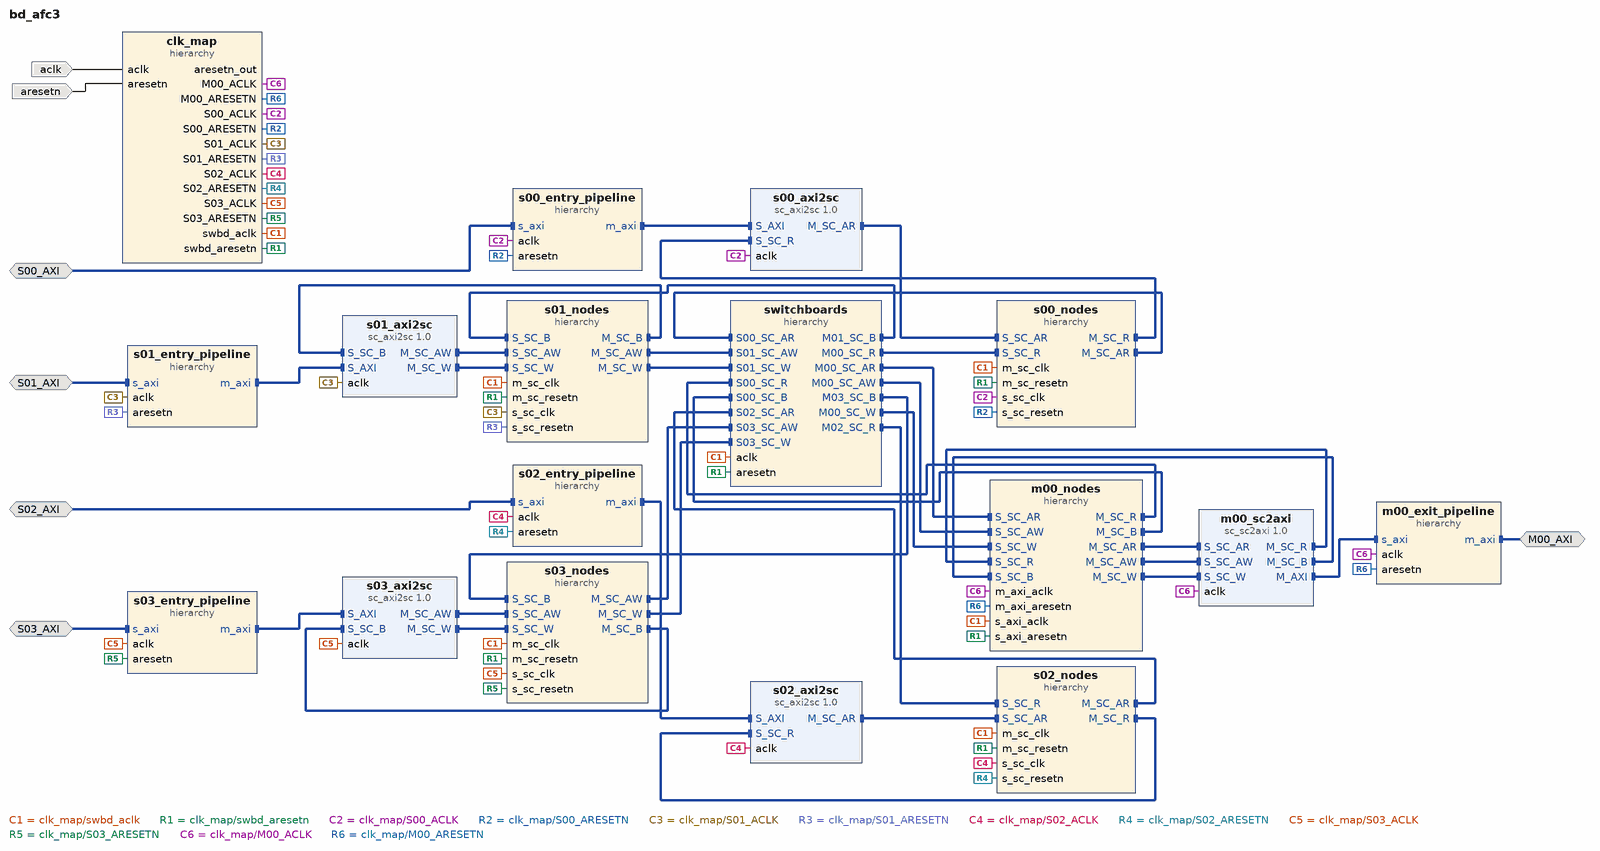
[diagram p0: block diagram of the top level]
# Vivado block design bd_afc3, xc7z020clg484-1, Vivado 2018.2
create_bd_design bd_afc3

create_bd_intf_port -mode Slave -vlnv xilinx.com:interface:aximm_rtl:1.0 S00_AXI
create_bd_intf_port -mode Slave -vlnv xilinx.com:interface:aximm_rtl:1.0 S01_AXI
create_bd_intf_port -mode Slave -vlnv xilinx.com:interface:aximm_rtl:1.0 S02_AXI
create_bd_intf_port -mode Slave -vlnv xilinx.com:interface:aximm_rtl:1.0 S03_AXI
create_bd_intf_port -mode Master -vlnv xilinx.com:interface:aximm_rtl:1.0 M00_AXI
set_property -dict [list \
  CONFIG.SUPPORTS_NARROW_BURST 0 \
  CONFIG.MAX_BURST_LENGTH 8 \
  CONFIG.RUSER_BITS_PER_BYTE 0 \
  CONFIG.WUSER_BITS_PER_BYTE 0 \
] [get_bd_intf_ports M00_AXI]
create_bd_port -dir I -type clk aclk
set_property -dict {CONFIG.ASSOCIATED_BUSIF M00_AXI:S00_AXI:S01_AXI:S02_AXI:S03_AXI} [get_bd_ports aclk]
create_bd_port -dir I -type rst aresetn
set_property -dict {CONFIG.POLARITY ACTIVE_LOW} [get_bd_ports aresetn]

create_bd_cell -type hier clk_map
create_bd_cell -type hier switchboards
create_bd_cell -type hier s00_entry_pipeline
create_bd_cell -type ip -vlnv xilinx.com:ip:sc_axi2sc:1.0 s00_axi2sc
set_property -dict [list \
  CONFIG.READ_WRITE_MODE READ_ONLY \
  CONFIG.AXI_ADDR_WIDTH 32 \
  CONFIG.AXI_ID_WIDTH 2 \
  CONFIG.AXI_RDATA_WIDTH 32 \
  CONFIG.AXI_WDATA_WIDTH 32 \
  CONFIG.SC_ADDR_WIDTH 32 \
  CONFIG.SC_ID_WIDTH 2 \
  CONFIG.SC_RDATA_WIDTH 64 \
  CONFIG.SC_WDATA_WIDTH 64 \
  CONFIG.SC_ARUSER_WIDTH 0 \
  CONFIG.SC_AWUSER_WIDTH 0 \
  CONFIG.SC_BUSER_WIDTH 0 \
  CONFIG.SC_WUSER_BITS_PER_BYTE 0 \
  CONFIG.SC_RUSER_BITS_PER_BYTE 0 \
  CONFIG.MSC_ROUTE_WIDTH 1 \
  CONFIG.SSC_ROUTE_WIDTH 4 \
] [get_bd_cells s00_axi2sc]
create_bd_cell -type hier s00_nodes
create_bd_cell -type hier s01_entry_pipeline
create_bd_cell -type ip -vlnv xilinx.com:ip:sc_axi2sc:1.0 s01_axi2sc
set_property -dict [list \
  CONFIG.READ_WRITE_MODE WRITE_ONLY \
  CONFIG.AXI_ADDR_WIDTH 32 \
  CONFIG.AXI_ID_WIDTH 2 \
  CONFIG.AXI_RDATA_WIDTH 32 \
  CONFIG.AXI_WDATA_WIDTH 32 \
  CONFIG.SC_ADDR_WIDTH 32 \
  CONFIG.SC_ID_WIDTH 2 \
  CONFIG.SC_RDATA_WIDTH 64 \
  CONFIG.SC_WDATA_WIDTH 64 \
  CONFIG.SC_ARUSER_WIDTH 0 \
  CONFIG.SC_AWUSER_WIDTH 0 \
  CONFIG.SC_BUSER_WIDTH 0 \
  CONFIG.SC_WUSER_BITS_PER_BYTE 0 \
  CONFIG.SC_RUSER_BITS_PER_BYTE 0 \
  CONFIG.MSC_ROUTE_WIDTH 1 \
  CONFIG.SSC_ROUTE_WIDTH 4 \
] [get_bd_cells s01_axi2sc]
create_bd_cell -type hier s01_nodes
create_bd_cell -type hier s02_entry_pipeline
create_bd_cell -type ip -vlnv xilinx.com:ip:sc_axi2sc:1.0 s02_axi2sc
set_property -dict [list \
  CONFIG.READ_WRITE_MODE READ_ONLY \
  CONFIG.AXI_ADDR_WIDTH 32 \
  CONFIG.AXI_ID_WIDTH 2 \
  CONFIG.AXI_RDATA_WIDTH 32 \
  CONFIG.AXI_WDATA_WIDTH 32 \
  CONFIG.SC_ADDR_WIDTH 32 \
  CONFIG.SC_ID_WIDTH 2 \
  CONFIG.SC_RDATA_WIDTH 64 \
  CONFIG.SC_WDATA_WIDTH 64 \
  CONFIG.SC_ARUSER_WIDTH 0 \
  CONFIG.SC_AWUSER_WIDTH 0 \
  CONFIG.SC_BUSER_WIDTH 0 \
  CONFIG.SC_WUSER_BITS_PER_BYTE 0 \
  CONFIG.SC_RUSER_BITS_PER_BYTE 0 \
  CONFIG.MSC_ROUTE_WIDTH 1 \
  CONFIG.SSC_ROUTE_WIDTH 4 \
] [get_bd_cells s02_axi2sc]
create_bd_cell -type hier s02_nodes
create_bd_cell -type hier s03_entry_pipeline
create_bd_cell -type ip -vlnv xilinx.com:ip:sc_axi2sc:1.0 s03_axi2sc
set_property -dict [list \
  CONFIG.READ_WRITE_MODE WRITE_ONLY \
  CONFIG.AXI_ADDR_WIDTH 32 \
  CONFIG.AXI_ID_WIDTH 2 \
  CONFIG.AXI_RDATA_WIDTH 32 \
  CONFIG.AXI_WDATA_WIDTH 32 \
  CONFIG.SC_ADDR_WIDTH 32 \
  CONFIG.SC_ID_WIDTH 2 \
  CONFIG.SC_RDATA_WIDTH 64 \
  CONFIG.SC_WDATA_WIDTH 64 \
  CONFIG.SC_ARUSER_WIDTH 0 \
  CONFIG.SC_AWUSER_WIDTH 0 \
  CONFIG.SC_BUSER_WIDTH 0 \
  CONFIG.SC_WUSER_BITS_PER_BYTE 0 \
  CONFIG.SC_RUSER_BITS_PER_BYTE 0 \
  CONFIG.MSC_ROUTE_WIDTH 1 \
  CONFIG.SSC_ROUTE_WIDTH 4 \
] [get_bd_cells s03_axi2sc]
create_bd_cell -type hier s03_nodes
create_bd_cell -type ip -vlnv xilinx.com:ip:sc_sc2axi:1.0 m00_sc2axi
set_property -dict [list \
  CONFIG.READ_WRITE_MODE READ_WRITE \
  CONFIG.AXI_ADDR_WIDTH 32 \
  CONFIG.AXI_ID_WIDTH 2 \
  CONFIG.AXI_RDATA_WIDTH 64 \
  CONFIG.AXI_WDATA_WIDTH 64 \
  CONFIG.SC_ADDR_WIDTH 32 \
  CONFIG.SC_ID_WIDTH 2 \
  CONFIG.SC_RDATA_WIDTH 64 \
  CONFIG.SC_WDATA_WIDTH 64 \
  CONFIG.SC_ARUSER_WIDTH 0 \
  CONFIG.SC_AWUSER_WIDTH 0 \
  CONFIG.SC_BUSER_WIDTH 0 \
  CONFIG.SC_WUSER_BITS_PER_BYTE 0 \
  CONFIG.SC_RUSER_BITS_PER_BYTE 0 \
  CONFIG.MSC_ROUTE_WIDTH 1 \
  CONFIG.SSC_ROUTE_WIDTH 4 \
] [get_bd_cells m00_sc2axi]
create_bd_cell -type hier m00_nodes
create_bd_cell -type hier m00_exit_pipeline

# ---- hierarchy /clk_map ----
current_bd_instance /clk_map
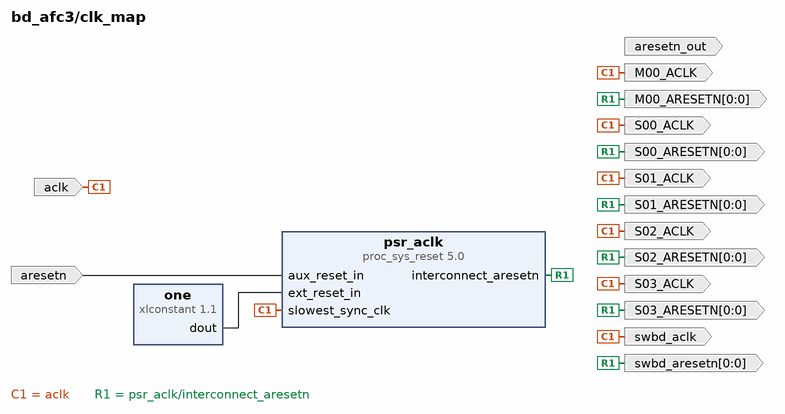
[diagram p1: block diagram inside /clk_map]
create_bd_pin -dir O -type clk S00_ACLK
create_bd_pin -dir O -from 0 -to 0 -type rst S00_ARESETN
create_bd_pin -dir O -type clk S01_ACLK
create_bd_pin -dir O -from 0 -to 0 -type rst S01_ARESETN
create_bd_pin -dir O -type clk S02_ACLK
create_bd_pin -dir O -from 0 -to 0 -type rst S02_ARESETN
create_bd_pin -dir O -type clk S03_ACLK
create_bd_pin -dir O -from 0 -to 0 -type rst S03_ARESETN
create_bd_pin -dir O -type clk M00_ACLK
create_bd_pin -dir O -from 0 -to 0 -type rst M00_ARESETN
create_bd_pin -dir O -type clk swbd_aclk
create_bd_pin -dir O -from 0 -to 0 -type rst swbd_aresetn
create_bd_pin -dir I -type rst aresetn
create_bd_pin -dir O -type rst aresetn_out
create_bd_pin -dir I -type clk aclk

create_bd_cell -type ip -vlnv xilinx.com:ip:xlconstant:1.1 one
create_bd_cell -type ip -vlnv xilinx.com:ip:proc_sys_reset:5.0 psr_aclk
set_property -dict {CONFIG.C_AUX_RESET_HIGH 0 CONFIG.C_AUX_RST_WIDTH 1} [get_bd_cells psr_aclk]

# ---- hierarchy /switchboards ----
current_bd_instance /switchboards
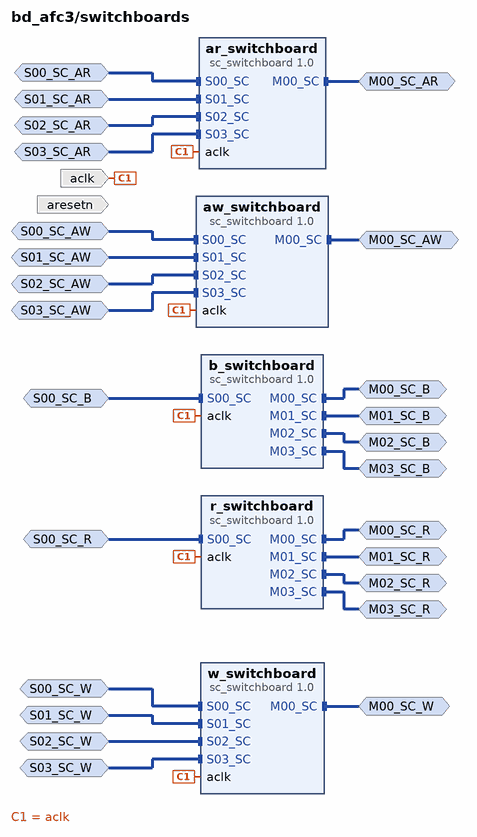
[diagram p2: block diagram inside /switchboards]
create_bd_intf_pin -mode Slave -vlnv xilinx.com:interface:sc_rtl:1.0 S00_SC_AR
create_bd_intf_pin -mode Slave -vlnv xilinx.com:interface:sc_rtl:1.0 S01_SC_AR
create_bd_intf_pin -mode Slave -vlnv xilinx.com:interface:sc_rtl:1.0 S02_SC_AR
create_bd_intf_pin -mode Slave -vlnv xilinx.com:interface:sc_rtl:1.0 S03_SC_AR
create_bd_intf_pin -mode Master -vlnv xilinx.com:interface:sc_rtl:1.0 M00_SC_AR
create_bd_intf_pin -mode Slave -vlnv xilinx.com:interface:sc_rtl:1.0 S00_SC_R
create_bd_intf_pin -mode Master -vlnv xilinx.com:interface:sc_rtl:1.0 M00_SC_R
create_bd_intf_pin -mode Master -vlnv xilinx.com:interface:sc_rtl:1.0 M01_SC_R
create_bd_intf_pin -mode Master -vlnv xilinx.com:interface:sc_rtl:1.0 M02_SC_R
create_bd_intf_pin -mode Master -vlnv xilinx.com:interface:sc_rtl:1.0 M03_SC_R
create_bd_intf_pin -mode Slave -vlnv xilinx.com:interface:sc_rtl:1.0 S00_SC_AW
create_bd_intf_pin -mode Slave -vlnv xilinx.com:interface:sc_rtl:1.0 S01_SC_AW
create_bd_intf_pin -mode Slave -vlnv xilinx.com:interface:sc_rtl:1.0 S02_SC_AW
create_bd_intf_pin -mode Slave -vlnv xilinx.com:interface:sc_rtl:1.0 S03_SC_AW
create_bd_intf_pin -mode Master -vlnv xilinx.com:interface:sc_rtl:1.0 M00_SC_AW
create_bd_intf_pin -mode Slave -vlnv xilinx.com:interface:sc_rtl:1.0 S00_SC_W
create_bd_intf_pin -mode Slave -vlnv xilinx.com:interface:sc_rtl:1.0 S01_SC_W
create_bd_intf_pin -mode Slave -vlnv xilinx.com:interface:sc_rtl:1.0 S02_SC_W
create_bd_intf_pin -mode Slave -vlnv xilinx.com:interface:sc_rtl:1.0 S03_SC_W
create_bd_intf_pin -mode Master -vlnv xilinx.com:interface:sc_rtl:1.0 M00_SC_W
create_bd_intf_pin -mode Slave -vlnv xilinx.com:interface:sc_rtl:1.0 S00_SC_B
create_bd_intf_pin -mode Master -vlnv xilinx.com:interface:sc_rtl:1.0 M00_SC_B
create_bd_intf_pin -mode Master -vlnv xilinx.com:interface:sc_rtl:1.0 M01_SC_B
create_bd_intf_pin -mode Master -vlnv xilinx.com:interface:sc_rtl:1.0 M02_SC_B
create_bd_intf_pin -mode Master -vlnv xilinx.com:interface:sc_rtl:1.0 M03_SC_B
create_bd_pin -dir I -type clk aclk
create_bd_pin -dir I -type rst aresetn

create_bd_cell -type ip -vlnv xilinx.com:ip:sc_switchboard:1.0 ar_switchboard
set_property -dict [list \
  CONFIG.S_PIPELINES 0 \
  CONFIG.M_PIPELINES 1 \
  CONFIG.S_LATENCY 0 \
  CONFIG.NUM_SI 4 \
  CONFIG.NUM_MI 1 \
  CONFIG.PAYLD_WIDTH 140 \
  CONFIG.M00_S00_CONNECTIVITY 1 \
  CONFIG.M00_S01_CONNECTIVITY 1 \
  CONFIG.M00_S02_CONNECTIVITY 1 \
  CONFIG.M00_S03_CONNECTIVITY 1 \
] [get_bd_cells ar_switchboard]
create_bd_cell -type ip -vlnv xilinx.com:ip:sc_switchboard:1.0 r_switchboard
set_property -dict [list \
  CONFIG.S_PIPELINES 0 \
  CONFIG.M_PIPELINES 1 \
  CONFIG.S_LATENCY 0 \
  CONFIG.NUM_SI 1 \
  CONFIG.NUM_MI 4 \
  CONFIG.PAYLD_WIDTH 87 \
  CONFIG.M00_S00_CONNECTIVITY 1 \
  CONFIG.M01_S00_CONNECTIVITY 1 \
  CONFIG.M02_S00_CONNECTIVITY 1 \
  CONFIG.M03_S00_CONNECTIVITY 1 \
] [get_bd_cells r_switchboard]
create_bd_cell -type ip -vlnv xilinx.com:ip:sc_switchboard:1.0 aw_switchboard
set_property -dict [list \
  CONFIG.S_PIPELINES 0 \
  CONFIG.M_PIPELINES 1 \
  CONFIG.S_LATENCY 0 \
  CONFIG.NUM_SI 4 \
  CONFIG.NUM_MI 1 \
  CONFIG.PAYLD_WIDTH 140 \
  CONFIG.M00_S00_CONNECTIVITY 1 \
  CONFIG.M00_S01_CONNECTIVITY 1 \
  CONFIG.M00_S02_CONNECTIVITY 1 \
  CONFIG.M00_S03_CONNECTIVITY 1 \
] [get_bd_cells aw_switchboard]
create_bd_cell -type ip -vlnv xilinx.com:ip:sc_switchboard:1.0 w_switchboard
set_property -dict [list \
  CONFIG.S_PIPELINES 0 \
  CONFIG.M_PIPELINES 1 \
  CONFIG.S_LATENCY 0 \
  CONFIG.NUM_SI 4 \
  CONFIG.NUM_MI 1 \
  CONFIG.PAYLD_WIDTH 88 \
  CONFIG.M00_S00_CONNECTIVITY 1 \
  CONFIG.M00_S01_CONNECTIVITY 1 \
  CONFIG.M00_S02_CONNECTIVITY 1 \
  CONFIG.M00_S03_CONNECTIVITY 1 \
] [get_bd_cells w_switchboard]
create_bd_cell -type ip -vlnv xilinx.com:ip:sc_switchboard:1.0 b_switchboard
set_property -dict [list \
  CONFIG.S_PIPELINES 0 \
  CONFIG.M_PIPELINES 1 \
  CONFIG.S_LATENCY 0 \
  CONFIG.NUM_SI 1 \
  CONFIG.NUM_MI 4 \
  CONFIG.PAYLD_WIDTH 9 \
  CONFIG.M00_S00_CONNECTIVITY 1 \
  CONFIG.M01_S00_CONNECTIVITY 1 \
  CONFIG.M02_S00_CONNECTIVITY 1 \
  CONFIG.M03_S00_CONNECTIVITY 1 \
] [get_bd_cells b_switchboard]

# ---- hierarchy /s00_entry_pipeline ----
current_bd_instance /s00_entry_pipeline
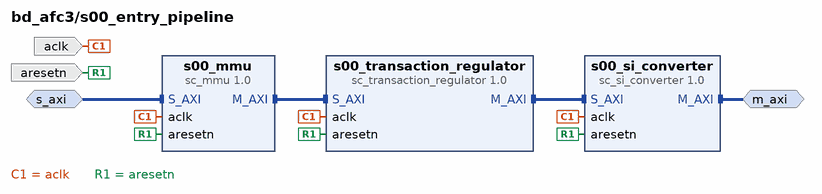
[diagram p3: block diagram inside /s00_entry_pipeline]
create_bd_intf_pin -mode Slave -vlnv xilinx.com:interface:aximm_rtl:1.0 s_axi
create_bd_intf_pin -mode Master -vlnv xilinx.com:interface:aximm_rtl:1.0 m_axi
create_bd_pin -dir I -type clk aclk
create_bd_pin -dir I -type rst aresetn

create_bd_cell -type ip -vlnv xilinx.com:ip:sc_mmu:1.0 s00_mmu
set_property -dict [list \
  CONFIG.IS_CASCADED 0 \
  CONFIG.NUM_SEG 2 \
  CONFIG.MSC_ROUTE_WIDTH 1 \
  CONFIG.NUM_MSC 1 \
  CONFIG.ADDR_WIDTH 32 \
  CONFIG.ID_WIDTH 0 \
  CONFIG.RDATA_WIDTH 32 \
  CONFIG.WDATA_WIDTH 32 \
  CONFIG.S_ARUSER_WIDTH 0 \
  CONFIG.S_RUSER_WIDTH 0 \
  CONFIG.S_WUSER_WIDTH 0 \
  CONFIG.S_PROTOCOL AXI4 \
  CONFIG.READ_WRITE_MODE READ_ONLY \
  CONFIG.SEG000_BASE_ADDR 0x0000000000000000 \
  CONFIG.SEG000_SIZE 29 \
  CONFIG.SEG000_SEP_ROUTE 0b0000000000000000000000000000000000000000000000000000000000000000 \
  CONFIG.SEG000_SUPPORTS_READ 1 \
  CONFIG.SEG000_SUPPORTS_WRITE 1 \
  CONFIG.SEG000_SECURE_READ 0 \
  CONFIG.SEG000_SECURE_WRITE 0 \
  CONFIG.SEG001_BASE_ADDR 0x00000000FC000000 \
  CONFIG.SEG001_SIZE 24 \
  CONFIG.SEG001_SEP_ROUTE 0b0000000000000000000000000000000000000000000000000000000000000000 \
  CONFIG.SEG001_SUPPORTS_READ 1 \
  CONFIG.SEG001_SUPPORTS_WRITE 1 \
  CONFIG.SEG001_SECURE_READ 0 \
  CONFIG.SEG001_SECURE_WRITE 0 \
  CONFIG.MSC000_ROUTE 0b1 \
] [get_bd_cells s00_mmu]
create_bd_cell -type ip -vlnv xilinx.com:ip:sc_transaction_regulator:1.0 s00_transaction_regulator
set_property -dict [list \
  CONFIG.READ_WRITE_MODE READ_ONLY \
  CONFIG.IS_CASCADED 0 \
  CONFIG.MEP_IDENTIFIER 0 \
  CONFIG.MEP_IDENTIFIER_WIDTH 2 \
  CONFIG.ADDR_WIDTH 32 \
  CONFIG.S_ID_WIDTH 0 \
  CONFIG.WDATA_WIDTH 32 \
  CONFIG.RDATA_WIDTH 32 \
  CONFIG.SEP_ROUTE_WIDTH 1 \
  CONFIG.SUPPORTS_READ_DEADLOCK 1 \
  CONFIG.SUPPORTS_WRITE_DEADLOCK 0 \
] [get_bd_cells s00_transaction_regulator]
create_bd_cell -type ip -vlnv xilinx.com:ip:sc_si_converter:1.0 s00_si_converter
set_property -dict [list \
  CONFIG.READ_WRITE_MODE READ_ONLY \
  CONFIG.LIMIT_READ_LENGTH 0 \
  CONFIG.LIMIT_WRITE_LENGTH 0 \
  CONFIG.IS_CASCADED 0 \
  CONFIG.NUM_READ_THREADS 1 \
  CONFIG.NUM_WRITE_THREADS 1 \
  CONFIG.MEP_IDENTIFIER_WIDTH 2 \
  CONFIG.SUPPORTS_NARROW 0 \
  CONFIG.HAS_BURST 0 \
  CONFIG.NUM_SEG 2 \
  CONFIG.ADDR_WIDTH 32 \
  CONFIG.ID_WIDTH 2 \
  CONFIG.RDATA_WIDTH 32 \
  CONFIG.WDATA_WIDTH 32 \
  CONFIG.NUM_MSC 1 \
  CONFIG.S_RUSER_BITS_PER_BYTE 0 \
  CONFIG.S_WUSER_BITS_PER_BYTE 0 \
  CONFIG.MAX_RUSER_BITS_PER_BYTE 0 \
  CONFIG.MAX_WUSER_BITS_PER_BYTE 0 \
  CONFIG.SEP000_RDATA_WIDTH 64 \
  CONFIG.SEP000_WDATA_WIDTH 64 \
  CONFIG.SEP000_PROTOCOL AXI3 \
  CONFIG.SEP001_RDATA_WIDTH 64 \
  CONFIG.SEP001_WDATA_WIDTH 64 \
  CONFIG.SEP001_PROTOCOL AXI3 \
  CONFIG.MSC000_RDATA_WIDTH 64 \
  CONFIG.MSC000_WDATA_WIDTH 64 \
] [get_bd_cells s00_si_converter]

# ---- hierarchy /s00_nodes ----
current_bd_instance /s00_nodes
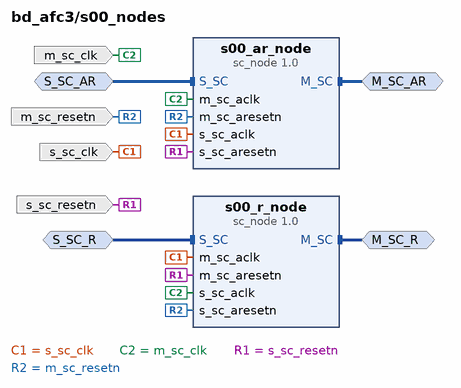
[diagram p4: block diagram inside /s00_nodes]
create_bd_intf_pin -mode Master -vlnv xilinx.com:interface:sc_rtl:1.0 M_SC_AR
create_bd_intf_pin -mode Slave -vlnv xilinx.com:interface:sc_rtl:1.0 S_SC_AR
create_bd_intf_pin -mode Master -vlnv xilinx.com:interface:sc_rtl:1.0 M_SC_R
create_bd_intf_pin -mode Slave -vlnv xilinx.com:interface:sc_rtl:1.0 S_SC_R
create_bd_pin -dir I -type clk s_sc_clk
create_bd_pin -dir I -type rst s_sc_resetn
create_bd_pin -dir I -type clk m_sc_clk
create_bd_pin -dir I -type rst m_sc_resetn

create_bd_cell -type ip -vlnv xilinx.com:ip:sc_node:1.0 s00_ar_node
set_property -dict [list \
  CONFIG.NUM_SI 1 \
  CONFIG.NUM_MI 1 \
  CONFIG.CHANNEL 2 \
  CONFIG.MAX_PAYLD_BYTES 8 \
  CONFIG.SC_ROUTE_WIDTH 1 \
  CONFIG.ID_WIDTH 2 \
  CONFIG.PAYLD_WIDTH 140 \
  CONFIG.ADDR_WIDTH 32 \
  CONFIG.USER_WIDTH 0 \
  CONFIG.M_PIPELINE 0 \
  CONFIG.ACLK_RELATIONSHIP 1 \
  CONFIG.ACLKEN_CONVERSION 0 \
  CONFIG.S00_NUM_BYTES 4 \
  CONFIG.S01_NUM_BYTES 4 \
  CONFIG.S02_NUM_BYTES 4 \
  CONFIG.S03_NUM_BYTES 4 \
  CONFIG.S04_NUM_BYTES 4 \
  CONFIG.S05_NUM_BYTES 4 \
  CONFIG.S06_NUM_BYTES 4 \
  CONFIG.S07_NUM_BYTES 4 \
  CONFIG.S08_NUM_BYTES 4 \
  CONFIG.S09_NUM_BYTES 4 \
  CONFIG.S10_NUM_BYTES 4 \
  CONFIG.S11_NUM_BYTES 4 \
  CONFIG.S12_NUM_BYTES 4 \
  CONFIG.S13_NUM_BYTES 4 \
  CONFIG.S14_NUM_BYTES 4 \
  CONFIG.S15_NUM_BYTES 4 \
  CONFIG.M00_NUM_BYTES 8 \
  CONFIG.M01_NUM_BYTES 8 \
  CONFIG.M02_NUM_BYTES 8 \
  CONFIG.M03_NUM_BYTES 8 \
  CONFIG.M04_NUM_BYTES 8 \
  CONFIG.M05_NUM_BYTES 8 \
  CONFIG.M06_NUM_BYTES 8 \
  CONFIG.M07_NUM_BYTES 8 \
  CONFIG.M08_NUM_BYTES 8 \
  CONFIG.M09_NUM_BYTES 8 \
  CONFIG.M10_NUM_BYTES 8 \
  CONFIG.M11_NUM_BYTES 8 \
  CONFIG.M12_NUM_BYTES 8 \
  CONFIG.M13_NUM_BYTES 8 \
  CONFIG.M14_NUM_BYTES 8 \
  CONFIG.M15_NUM_BYTES 8 \
] [get_bd_cells s00_ar_node]
create_bd_cell -type ip -vlnv xilinx.com:ip:sc_node:1.0 s00_r_node
set_property -dict [list \
  CONFIG.NUM_SI 1 \
  CONFIG.NUM_MI 1 \
  CONFIG.CHANNEL 0 \
  CONFIG.USER_BITS_PER_BYTE 0 \
  CONFIG.MAX_PAYLD_BYTES 8 \
  CONFIG.SC_ROUTE_WIDTH 4 \
  CONFIG.ID_WIDTH 2 \
  CONFIG.PAYLD_WIDTH 87 \
  CONFIG.ADDR_WIDTH 32 \
  CONFIG.M_SEND_PIPELINE 0 \
  CONFIG.S_LATENCY 1 \
  CONFIG.ACLK_RELATIONSHIP 1 \
  CONFIG.ACLKEN_CONVERSION 0 \
  CONFIG.S00_NUM_BYTES 8 \
  CONFIG.S01_NUM_BYTES 8 \
  CONFIG.S02_NUM_BYTES 8 \
  CONFIG.S03_NUM_BYTES 8 \
  CONFIG.S04_NUM_BYTES 8 \
  CONFIG.S05_NUM_BYTES 8 \
  CONFIG.S06_NUM_BYTES 8 \
  CONFIG.S07_NUM_BYTES 8 \
  CONFIG.S08_NUM_BYTES 8 \
  CONFIG.S09_NUM_BYTES 8 \
  CONFIG.S10_NUM_BYTES 8 \
  CONFIG.S11_NUM_BYTES 8 \
  CONFIG.S12_NUM_BYTES 8 \
  CONFIG.S13_NUM_BYTES 8 \
  CONFIG.S14_NUM_BYTES 8 \
  CONFIG.S15_NUM_BYTES 8 \
  CONFIG.M00_NUM_BYTES 4 \
  CONFIG.M01_NUM_BYTES 4 \
  CONFIG.M02_NUM_BYTES 4 \
  CONFIG.M03_NUM_BYTES 4 \
  CONFIG.M04_NUM_BYTES 4 \
  CONFIG.M05_NUM_BYTES 4 \
  CONFIG.M06_NUM_BYTES 4 \
  CONFIG.M07_NUM_BYTES 4 \
  CONFIG.M08_NUM_BYTES 4 \
  CONFIG.M09_NUM_BYTES 4 \
  CONFIG.M10_NUM_BYTES 4 \
  CONFIG.M11_NUM_BYTES 4 \
  CONFIG.M12_NUM_BYTES 4 \
  CONFIG.M13_NUM_BYTES 4 \
  CONFIG.M14_NUM_BYTES 4 \
  CONFIG.M15_NUM_BYTES 4 \
] [get_bd_cells s00_r_node]

# ---- hierarchy /s01_entry_pipeline ----
current_bd_instance /s01_entry_pipeline
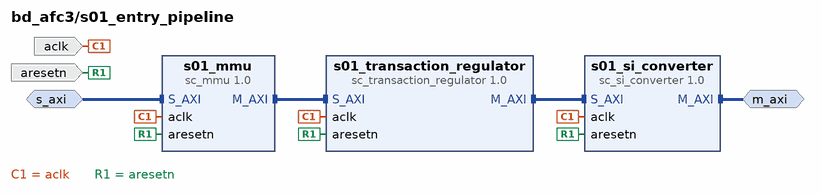
[diagram p5: block diagram inside /s01_entry_pipeline]
create_bd_intf_pin -mode Slave -vlnv xilinx.com:interface:aximm_rtl:1.0 s_axi
create_bd_intf_pin -mode Master -vlnv xilinx.com:interface:aximm_rtl:1.0 m_axi
create_bd_pin -dir I -type clk aclk
create_bd_pin -dir I -type rst aresetn

create_bd_cell -type ip -vlnv xilinx.com:ip:sc_mmu:1.0 s01_mmu
set_property -dict [list \
  CONFIG.IS_CASCADED 0 \
  CONFIG.NUM_SEG 2 \
  CONFIG.MSC_ROUTE_WIDTH 1 \
  CONFIG.NUM_MSC 1 \
  CONFIG.ADDR_WIDTH 32 \
  CONFIG.ID_WIDTH 0 \
  CONFIG.RDATA_WIDTH 32 \
  CONFIG.WDATA_WIDTH 32 \
  CONFIG.S_AWUSER_WIDTH 0 \
  CONFIG.S_RUSER_WIDTH 0 \
  CONFIG.S_WUSER_WIDTH 0 \
  CONFIG.S_BUSER_WIDTH 0 \
  CONFIG.S_PROTOCOL AXI4 \
  CONFIG.READ_WRITE_MODE WRITE_ONLY \
  CONFIG.SEG000_BASE_ADDR 0x0000000000000000 \
  CONFIG.SEG000_SIZE 29 \
  CONFIG.SEG000_SEP_ROUTE 0b0000000000000000000000000000000000000000000000000000000000000000 \
  CONFIG.SEG000_SUPPORTS_READ 1 \
  CONFIG.SEG000_SUPPORTS_WRITE 1 \
  CONFIG.SEG000_SECURE_READ 0 \
  CONFIG.SEG000_SECURE_WRITE 0 \
  CONFIG.SEG001_BASE_ADDR 0x00000000FC000000 \
  CONFIG.SEG001_SIZE 24 \
  CONFIG.SEG001_SEP_ROUTE 0b0000000000000000000000000000000000000000000000000000000000000000 \
  CONFIG.SEG001_SUPPORTS_READ 1 \
  CONFIG.SEG001_SUPPORTS_WRITE 1 \
  CONFIG.SEG001_SECURE_READ 0 \
  CONFIG.SEG001_SECURE_WRITE 0 \
  CONFIG.MSC000_ROUTE 0b1 \
] [get_bd_cells s01_mmu]
create_bd_cell -type ip -vlnv xilinx.com:ip:sc_transaction_regulator:1.0 s01_transaction_regulator
set_property -dict [list \
  CONFIG.READ_WRITE_MODE WRITE_ONLY \
  CONFIG.IS_CASCADED 0 \
  CONFIG.MEP_IDENTIFIER 1 \
  CONFIG.MEP_IDENTIFIER_WIDTH 2 \
  CONFIG.ADDR_WIDTH 32 \
  CONFIG.S_ID_WIDTH 0 \
  CONFIG.WDATA_WIDTH 32 \
  CONFIG.RDATA_WIDTH 32 \
  CONFIG.SEP_ROUTE_WIDTH 1 \
  CONFIG.SUPPORTS_READ_DEADLOCK 0 \
  CONFIG.SUPPORTS_WRITE_DEADLOCK 1 \
] [get_bd_cells s01_transaction_regulator]
create_bd_cell -type ip -vlnv xilinx.com:ip:sc_si_converter:1.0 s01_si_converter
set_property -dict [list \
  CONFIG.READ_WRITE_MODE WRITE_ONLY \
  CONFIG.LIMIT_READ_LENGTH 0 \
  CONFIG.LIMIT_WRITE_LENGTH 0 \
  CONFIG.IS_CASCADED 0 \
  CONFIG.NUM_READ_THREADS 1 \
  CONFIG.NUM_WRITE_THREADS 1 \
  CONFIG.MEP_IDENTIFIER_WIDTH 2 \
  CONFIG.SUPPORTS_NARROW 0 \
  CONFIG.HAS_BURST 0 \
  CONFIG.NUM_SEG 2 \
  CONFIG.ADDR_WIDTH 32 \
  CONFIG.ID_WIDTH 2 \
  CONFIG.RDATA_WIDTH 32 \
  CONFIG.WDATA_WIDTH 32 \
  CONFIG.NUM_MSC 1 \
  CONFIG.S_RUSER_BITS_PER_BYTE 0 \
  CONFIG.S_WUSER_BITS_PER_BYTE 0 \
  CONFIG.MAX_RUSER_BITS_PER_BYTE 0 \
  CONFIG.MAX_WUSER_BITS_PER_BYTE 0 \
  CONFIG.SEP000_RDATA_WIDTH 64 \
  CONFIG.SEP000_WDATA_WIDTH 64 \
  CONFIG.SEP000_PROTOCOL AXI3 \
  CONFIG.SEP001_RDATA_WIDTH 64 \
  CONFIG.SEP001_WDATA_WIDTH 64 \
  CONFIG.SEP001_PROTOCOL AXI3 \
  CONFIG.MSC000_RDATA_WIDTH 64 \
  CONFIG.MSC000_WDATA_WIDTH 64 \
] [get_bd_cells s01_si_converter]

# ---- hierarchy /s01_nodes ----
current_bd_instance /s01_nodes
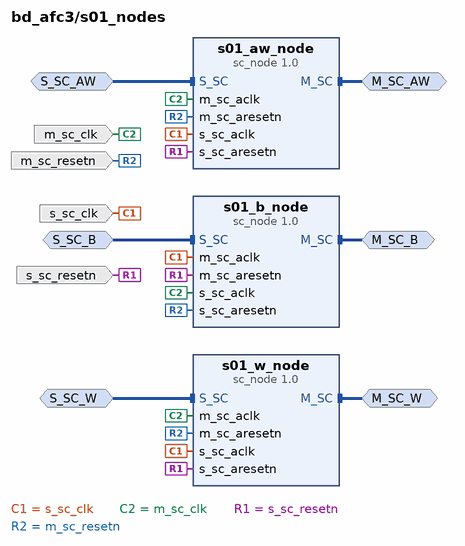
[diagram p6: block diagram inside /s01_nodes]
create_bd_intf_pin -mode Master -vlnv xilinx.com:interface:sc_rtl:1.0 M_SC_AW
create_bd_intf_pin -mode Slave -vlnv xilinx.com:interface:sc_rtl:1.0 S_SC_AW
create_bd_intf_pin -mode Master -vlnv xilinx.com:interface:sc_rtl:1.0 M_SC_W
create_bd_intf_pin -mode Slave -vlnv xilinx.com:interface:sc_rtl:1.0 S_SC_W
create_bd_intf_pin -mode Master -vlnv xilinx.com:interface:sc_rtl:1.0 M_SC_B
create_bd_intf_pin -mode Slave -vlnv xilinx.com:interface:sc_rtl:1.0 S_SC_B
create_bd_pin -dir I -type clk s_sc_clk
create_bd_pin -dir I -type rst s_sc_resetn
create_bd_pin -dir I -type clk m_sc_clk
create_bd_pin -dir I -type rst m_sc_resetn

create_bd_cell -type ip -vlnv xilinx.com:ip:sc_node:1.0 s01_aw_node
set_property -dict [list \
  CONFIG.NUM_SI 1 \
  CONFIG.NUM_MI 1 \
  CONFIG.CHANNEL 3 \
  CONFIG.MAX_PAYLD_BYTES 8 \
  CONFIG.SC_ROUTE_WIDTH 1 \
  CONFIG.ID_WIDTH 2 \
  CONFIG.PAYLD_WIDTH 140 \
  CONFIG.ADDR_WIDTH 32 \
  CONFIG.USER_WIDTH 0 \
  CONFIG.M_PIPELINE 0 \
  CONFIG.ACLK_RELATIONSHIP 1 \
  CONFIG.ACLKEN_CONVERSION 0 \
  CONFIG.S00_NUM_BYTES 4 \
  CONFIG.S01_NUM_BYTES 4 \
  CONFIG.S02_NUM_BYTES 4 \
  CONFIG.S03_NUM_BYTES 4 \
  CONFIG.S04_NUM_BYTES 4 \
  CONFIG.S05_NUM_BYTES 4 \
  CONFIG.S06_NUM_BYTES 4 \
  CONFIG.S07_NUM_BYTES 4 \
  CONFIG.S08_NUM_BYTES 4 \
  CONFIG.S09_NUM_BYTES 4 \
  CONFIG.S10_NUM_BYTES 4 \
  CONFIG.S11_NUM_BYTES 4 \
  CONFIG.S12_NUM_BYTES 4 \
  CONFIG.S13_NUM_BYTES 4 \
  CONFIG.S14_NUM_BYTES 4 \
  CONFIG.S15_NUM_BYTES 4 \
  CONFIG.M00_NUM_BYTES 8 \
  CONFIG.M01_NUM_BYTES 8 \
  CONFIG.M02_NUM_BYTES 8 \
  CONFIG.M03_NUM_BYTES 8 \
  CONFIG.M04_NUM_BYTES 8 \
  CONFIG.M05_NUM_BYTES 8 \
  CONFIG.M06_NUM_BYTES 8 \
  CONFIG.M07_NUM_BYTES 8 \
  CONFIG.M08_NUM_BYTES 8 \
  CONFIG.M09_NUM_BYTES 8 \
  CONFIG.M10_NUM_BYTES 8 \
  CONFIG.M11_NUM_BYTES 8 \
  CONFIG.M12_NUM_BYTES 8 \
  CONFIG.M13_NUM_BYTES 8 \
  CONFIG.M14_NUM_BYTES 8 \
  CONFIG.M15_NUM_BYTES 8 \
] [get_bd_cells s01_aw_node]
create_bd_cell -type ip -vlnv xilinx.com:ip:sc_node:1.0 s01_w_node
set_property -dict [list \
  CONFIG.NUM_SI 1 \
  CONFIG.NUM_MI 1 \
  CONFIG.CHANNEL 1 \
  CONFIG.USER_BITS_PER_BYTE 0 \
  CONFIG.MAX_PAYLD_BYTES 8 \
  CONFIG.SC_ROUTE_WIDTH 1 \
  CONFIG.ID_WIDTH 2 \
  CONFIG.PAYLD_WIDTH 88 \
  CONFIG.ADDR_WIDTH 32 \
  CONFIG.M_PIPELINE 0 \
  CONFIG.ACLK_RELATIONSHIP 1 \
  CONFIG.ACLKEN_CONVERSION 0 \
  CONFIG.S00_NUM_BYTES 4 \
  CONFIG.S01_NUM_BYTES 4 \
  CONFIG.S02_NUM_BYTES 4 \
  CONFIG.S03_NUM_BYTES 4 \
  CONFIG.S04_NUM_BYTES 4 \
  CONFIG.S05_NUM_BYTES 4 \
  CONFIG.S06_NUM_BYTES 4 \
  CONFIG.S07_NUM_BYTES 4 \
  CONFIG.S08_NUM_BYTES 4 \
  CONFIG.S09_NUM_BYTES 4 \
  CONFIG.S10_NUM_BYTES 4 \
  CONFIG.S11_NUM_BYTES 4 \
  CONFIG.S12_NUM_BYTES 4 \
  CONFIG.S13_NUM_BYTES 4 \
  CONFIG.S14_NUM_BYTES 4 \
  CONFIG.S15_NUM_BYTES 4 \
  CONFIG.M00_NUM_BYTES 8 \
  CONFIG.M01_NUM_BYTES 8 \
  CONFIG.M02_NUM_BYTES 8 \
  CONFIG.M03_NUM_BYTES 8 \
  CONFIG.M04_NUM_BYTES 8 \
  CONFIG.M05_NUM_BYTES 8 \
  CONFIG.M06_NUM_BYTES 8 \
  CONFIG.M07_NUM_BYTES 8 \
  CONFIG.M08_NUM_BYTES 8 \
  CONFIG.M09_NUM_BYTES 8 \
  CONFIG.M10_NUM_BYTES 8 \
  CONFIG.M11_NUM_BYTES 8 \
  CONFIG.M12_NUM_BYTES 8 \
  CONFIG.M13_NUM_BYTES 8 \
  CONFIG.M14_NUM_BYTES 8 \
  CONFIG.M15_NUM_BYTES 8 \
] [get_bd_cells s01_w_node]
create_bd_cell -type ip -vlnv xilinx.com:ip:sc_node:1.0 s01_b_node
set_property -dict [list \
  CONFIG.NUM_SI 1 \
  CONFIG.NUM_MI 1 \
  CONFIG.CHANNEL 4 \
  CONFIG.MAX_PAYLD_BYTES 8 \
  CONFIG.SC_ROUTE_WIDTH 4 \
  CONFIG.ID_WIDTH 2 \
  CONFIG.PAYLD_WIDTH 9 \
  CONFIG.ADDR_WIDTH 32 \
  CONFIG.USER_WIDTH 0 \
  CONFIG.M_SEND_PIPELINE 0 \
  CONFIG.S_LATENCY 1 \
  CONFIG.ACLK_RELATIONSHIP 1 \
  CONFIG.ACLKEN_CONVERSION 0 \
  CONFIG.S00_NUM_BYTES 8 \
  CONFIG.S01_NUM_BYTES 8 \
  CONFIG.S02_NUM_BYTES 8 \
  CONFIG.S03_NUM_BYTES 8 \
  CONFIG.S04_NUM_BYTES 8 \
  CONFIG.S05_NUM_BYTES 8 \
  CONFIG.S06_NUM_BYTES 8 \
  CONFIG.S07_NUM_BYTES 8 \
  CONFIG.S08_NUM_BYTES 8 \
  CONFIG.S09_NUM_BYTES 8 \
  CONFIG.S10_NUM_BYTES 8 \
  CONFIG.S11_NUM_BYTES 8 \
  CONFIG.S12_NUM_BYTES 8 \
  CONFIG.S13_NUM_BYTES 8 \
  CONFIG.S14_NUM_BYTES 8 \
  CONFIG.S15_NUM_BYTES 8 \
  CONFIG.M00_NUM_BYTES 4 \
  CONFIG.M01_NUM_BYTES 4 \
  CONFIG.M02_NUM_BYTES 4 \
  CONFIG.M03_NUM_BYTES 4 \
  CONFIG.M04_NUM_BYTES 4 \
  CONFIG.M05_NUM_BYTES 4 \
  CONFIG.M06_NUM_BYTES 4 \
  CONFIG.M07_NUM_BYTES 4 \
  CONFIG.M08_NUM_BYTES 4 \
  CONFIG.M09_NUM_BYTES 4 \
  CONFIG.M10_NUM_BYTES 4 \
  CONFIG.M11_NUM_BYTES 4 \
  CONFIG.M12_NUM_BYTES 4 \
  CONFIG.M13_NUM_BYTES 4 \
  CONFIG.M14_NUM_BYTES 4 \
  CONFIG.M15_NUM_BYTES 4 \
] [get_bd_cells s01_b_node]

# ---- hierarchy /s02_entry_pipeline ----
current_bd_instance /s02_entry_pipeline
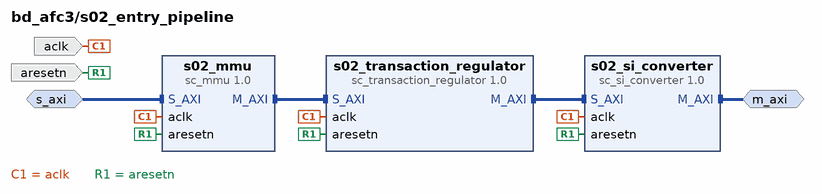
[diagram p7: block diagram inside /s02_entry_pipeline]
create_bd_intf_pin -mode Slave -vlnv xilinx.com:interface:aximm_rtl:1.0 s_axi
create_bd_intf_pin -mode Master -vlnv xilinx.com:interface:aximm_rtl:1.0 m_axi
create_bd_pin -dir I -type clk aclk
create_bd_pin -dir I -type rst aresetn

create_bd_cell -type ip -vlnv xilinx.com:ip:sc_mmu:1.0 s02_mmu
set_property -dict [list \
  CONFIG.IS_CASCADED 0 \
  CONFIG.NUM_SEG 2 \
  CONFIG.MSC_ROUTE_WIDTH 1 \
  CONFIG.NUM_MSC 1 \
  CONFIG.ADDR_WIDTH 32 \
  CONFIG.ID_WIDTH 0 \
  CONFIG.RDATA_WIDTH 32 \
  CONFIG.WDATA_WIDTH 32 \
  CONFIG.S_ARUSER_WIDTH 0 \
  CONFIG.S_RUSER_WIDTH 0 \
  CONFIG.S_WUSER_WIDTH 0 \
  CONFIG.S_PROTOCOL AXI4 \
  CONFIG.READ_WRITE_MODE READ_ONLY \
  CONFIG.SEG000_BASE_ADDR 0x0000000000000000 \
  CONFIG.SEG000_SIZE 29 \
  CONFIG.SEG000_SEP_ROUTE 0b0000000000000000000000000000000000000000000000000000000000000000 \
  CONFIG.SEG000_SUPPORTS_READ 1 \
  CONFIG.SEG000_SUPPORTS_WRITE 1 \
  CONFIG.SEG000_SECURE_READ 0 \
  CONFIG.SEG000_SECURE_WRITE 0 \
  CONFIG.SEG001_BASE_ADDR 0x00000000FC000000 \
  CONFIG.SEG001_SIZE 24 \
  CONFIG.SEG001_SEP_ROUTE 0b0000000000000000000000000000000000000000000000000000000000000000 \
  CONFIG.SEG001_SUPPORTS_READ 1 \
  CONFIG.SEG001_SUPPORTS_WRITE 1 \
  CONFIG.SEG001_SECURE_READ 0 \
  CONFIG.SEG001_SECURE_WRITE 0 \
  CONFIG.MSC000_ROUTE 0b1 \
] [get_bd_cells s02_mmu]
create_bd_cell -type ip -vlnv xilinx.com:ip:sc_transaction_regulator:1.0 s02_transaction_regulator
set_property -dict [list \
  CONFIG.READ_WRITE_MODE READ_ONLY \
  CONFIG.IS_CASCADED 0 \
  CONFIG.MEP_IDENTIFIER 2 \
  CONFIG.MEP_IDENTIFIER_WIDTH 2 \
  CONFIG.ADDR_WIDTH 32 \
  CONFIG.S_ID_WIDTH 0 \
  CONFIG.WDATA_WIDTH 32 \
  CONFIG.RDATA_WIDTH 32 \
  CONFIG.SEP_ROUTE_WIDTH 1 \
  CONFIG.SUPPORTS_READ_DEADLOCK 1 \
  CONFIG.SUPPORTS_WRITE_DEADLOCK 0 \
] [get_bd_cells s02_transaction_regulator]
create_bd_cell -type ip -vlnv xilinx.com:ip:sc_si_converter:1.0 s02_si_converter
set_property -dict [list \
  CONFIG.READ_WRITE_MODE READ_ONLY \
  CONFIG.LIMIT_READ_LENGTH 0 \
  CONFIG.LIMIT_WRITE_LENGTH 0 \
  CONFIG.IS_CASCADED 0 \
  CONFIG.NUM_READ_THREADS 1 \
  CONFIG.NUM_WRITE_THREADS 1 \
  CONFIG.MEP_IDENTIFIER_WIDTH 2 \
  CONFIG.SUPPORTS_NARROW 0 \
  CONFIG.HAS_BURST 0 \
  CONFIG.NUM_SEG 2 \
  CONFIG.ADDR_WIDTH 32 \
  CONFIG.ID_WIDTH 2 \
  CONFIG.RDATA_WIDTH 32 \
  CONFIG.WDATA_WIDTH 32 \
  CONFIG.NUM_MSC 1 \
  CONFIG.S_RUSER_BITS_PER_BYTE 0 \
  CONFIG.S_WUSER_BITS_PER_BYTE 0 \
  CONFIG.MAX_RUSER_BITS_PER_BYTE 0 \
  CONFIG.MAX_WUSER_BITS_PER_BYTE 0 \
  CONFIG.SEP000_RDATA_WIDTH 64 \
  CONFIG.SEP000_WDATA_WIDTH 64 \
  CONFIG.SEP000_PROTOCOL AXI3 \
  CONFIG.SEP001_RDATA_WIDTH 64 \
  CONFIG.SEP001_WDATA_WIDTH 64 \
  CONFIG.SEP001_PROTOCOL AXI3 \
  CONFIG.MSC000_RDATA_WIDTH 64 \
  CONFIG.MSC000_WDATA_WIDTH 64 \
] [get_bd_cells s02_si_converter]

# ---- hierarchy /s02_nodes ----
current_bd_instance /s02_nodes
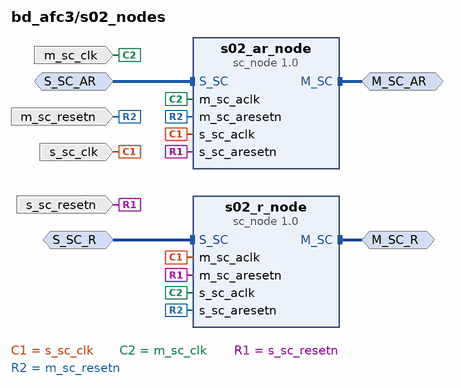
[diagram p8: block diagram inside /s02_nodes]
create_bd_intf_pin -mode Master -vlnv xilinx.com:interface:sc_rtl:1.0 M_SC_AR
create_bd_intf_pin -mode Slave -vlnv xilinx.com:interface:sc_rtl:1.0 S_SC_AR
create_bd_intf_pin -mode Master -vlnv xilinx.com:interface:sc_rtl:1.0 M_SC_R
create_bd_intf_pin -mode Slave -vlnv xilinx.com:interface:sc_rtl:1.0 S_SC_R
create_bd_pin -dir I -type clk s_sc_clk
create_bd_pin -dir I -type rst s_sc_resetn
create_bd_pin -dir I -type clk m_sc_clk
create_bd_pin -dir I -type rst m_sc_resetn

create_bd_cell -type ip -vlnv xilinx.com:ip:sc_node:1.0 s02_ar_node
set_property -dict [list \
  CONFIG.NUM_SI 1 \
  CONFIG.NUM_MI 1 \
  CONFIG.CHANNEL 2 \
  CONFIG.MAX_PAYLD_BYTES 8 \
  CONFIG.SC_ROUTE_WIDTH 1 \
  CONFIG.ID_WIDTH 2 \
  CONFIG.PAYLD_WIDTH 140 \
  CONFIG.ADDR_WIDTH 32 \
  CONFIG.USER_WIDTH 0 \
  CONFIG.M_PIPELINE 0 \
  CONFIG.ACLK_RELATIONSHIP 1 \
  CONFIG.ACLKEN_CONVERSION 0 \
  CONFIG.S00_NUM_BYTES 4 \
  CONFIG.S01_NUM_BYTES 4 \
  CONFIG.S02_NUM_BYTES 4 \
  CONFIG.S03_NUM_BYTES 4 \
  CONFIG.S04_NUM_BYTES 4 \
  CONFIG.S05_NUM_BYTES 4 \
  CONFIG.S06_NUM_BYTES 4 \
  CONFIG.S07_NUM_BYTES 4 \
  CONFIG.S08_NUM_BYTES 4 \
  CONFIG.S09_NUM_BYTES 4 \
  CONFIG.S10_NUM_BYTES 4 \
  CONFIG.S11_NUM_BYTES 4 \
  CONFIG.S12_NUM_BYTES 4 \
  CONFIG.S13_NUM_BYTES 4 \
  CONFIG.S14_NUM_BYTES 4 \
  CONFIG.S15_NUM_BYTES 4 \
  CONFIG.M00_NUM_BYTES 8 \
  CONFIG.M01_NUM_BYTES 8 \
  CONFIG.M02_NUM_BYTES 8 \
  CONFIG.M03_NUM_BYTES 8 \
  CONFIG.M04_NUM_BYTES 8 \
  CONFIG.M05_NUM_BYTES 8 \
  CONFIG.M06_NUM_BYTES 8 \
  CONFIG.M07_NUM_BYTES 8 \
  CONFIG.M08_NUM_BYTES 8 \
  CONFIG.M09_NUM_BYTES 8 \
  CONFIG.M10_NUM_BYTES 8 \
  CONFIG.M11_NUM_BYTES 8 \
  CONFIG.M12_NUM_BYTES 8 \
  CONFIG.M13_NUM_BYTES 8 \
  CONFIG.M14_NUM_BYTES 8 \
  CONFIG.M15_NUM_BYTES 8 \
] [get_bd_cells s02_ar_node]
create_bd_cell -type ip -vlnv xilinx.com:ip:sc_node:1.0 s02_r_node
set_property -dict [list \
  CONFIG.NUM_SI 1 \
  CONFIG.NUM_MI 1 \
  CONFIG.CHANNEL 0 \
  CONFIG.USER_BITS_PER_BYTE 0 \
  CONFIG.MAX_PAYLD_BYTES 8 \
  CONFIG.SC_ROUTE_WIDTH 4 \
  CONFIG.ID_WIDTH 2 \
  CONFIG.PAYLD_WIDTH 87 \
  CONFIG.ADDR_WIDTH 32 \
  CONFIG.M_SEND_PIPELINE 0 \
  CONFIG.S_LATENCY 1 \
  CONFIG.ACLK_RELATIONSHIP 1 \
  CONFIG.ACLKEN_CONVERSION 0 \
  CONFIG.S00_NUM_BYTES 8 \
  CONFIG.S01_NUM_BYTES 8 \
  CONFIG.S02_NUM_BYTES 8 \
  CONFIG.S03_NUM_BYTES 8 \
  CONFIG.S04_NUM_BYTES 8 \
  CONFIG.S05_NUM_BYTES 8 \
  CONFIG.S06_NUM_BYTES 8 \
  CONFIG.S07_NUM_BYTES 8 \
  CONFIG.S08_NUM_BYTES 8 \
  CONFIG.S09_NUM_BYTES 8 \
  CONFIG.S10_NUM_BYTES 8 \
  CONFIG.S11_NUM_BYTES 8 \
  CONFIG.S12_NUM_BYTES 8 \
  CONFIG.S13_NUM_BYTES 8 \
  CONFIG.S14_NUM_BYTES 8 \
  CONFIG.S15_NUM_BYTES 8 \
  CONFIG.M00_NUM_BYTES 4 \
  CONFIG.M01_NUM_BYTES 4 \
  CONFIG.M02_NUM_BYTES 4 \
  CONFIG.M03_NUM_BYTES 4 \
  CONFIG.M04_NUM_BYTES 4 \
  CONFIG.M05_NUM_BYTES 4 \
  CONFIG.M06_NUM_BYTES 4 \
  CONFIG.M07_NUM_BYTES 4 \
  CONFIG.M08_NUM_BYTES 4 \
  CONFIG.M09_NUM_BYTES 4 \
  CONFIG.M10_NUM_BYTES 4 \
  CONFIG.M11_NUM_BYTES 4 \
  CONFIG.M12_NUM_BYTES 4 \
  CONFIG.M13_NUM_BYTES 4 \
  CONFIG.M14_NUM_BYTES 4 \
  CONFIG.M15_NUM_BYTES 4 \
] [get_bd_cells s02_r_node]

# ---- hierarchy /s03_entry_pipeline ----
current_bd_instance /s03_entry_pipeline
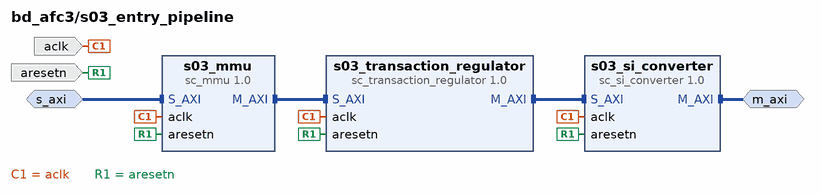
[diagram p9: block diagram inside /s03_entry_pipeline]
create_bd_intf_pin -mode Slave -vlnv xilinx.com:interface:aximm_rtl:1.0 s_axi
create_bd_intf_pin -mode Master -vlnv xilinx.com:interface:aximm_rtl:1.0 m_axi
create_bd_pin -dir I -type clk aclk
create_bd_pin -dir I -type rst aresetn

create_bd_cell -type ip -vlnv xilinx.com:ip:sc_mmu:1.0 s03_mmu
set_property -dict [list \
  CONFIG.IS_CASCADED 0 \
  CONFIG.NUM_SEG 2 \
  CONFIG.MSC_ROUTE_WIDTH 1 \
  CONFIG.NUM_MSC 1 \
  CONFIG.ADDR_WIDTH 32 \
  CONFIG.ID_WIDTH 0 \
  CONFIG.RDATA_WIDTH 32 \
  CONFIG.WDATA_WIDTH 32 \
  CONFIG.S_AWUSER_WIDTH 0 \
  CONFIG.S_RUSER_WIDTH 0 \
  CONFIG.S_WUSER_WIDTH 0 \
  CONFIG.S_BUSER_WIDTH 0 \
  CONFIG.S_PROTOCOL AXI4 \
  CONFIG.READ_WRITE_MODE WRITE_ONLY \
  CONFIG.SEG000_BASE_ADDR 0x0000000000000000 \
  CONFIG.SEG000_SIZE 29 \
  CONFIG.SEG000_SEP_ROUTE 0b0000000000000000000000000000000000000000000000000000000000000000 \
  CONFIG.SEG000_SUPPORTS_READ 1 \
  CONFIG.SEG000_SUPPORTS_WRITE 1 \
  CONFIG.SEG000_SECURE_READ 0 \
  CONFIG.SEG000_SECURE_WRITE 0 \
  CONFIG.SEG001_BASE_ADDR 0x00000000FC000000 \
  CONFIG.SEG001_SIZE 24 \
  CONFIG.SEG001_SEP_ROUTE 0b0000000000000000000000000000000000000000000000000000000000000000 \
  CONFIG.SEG001_SUPPORTS_READ 1 \
  CONFIG.SEG001_SUPPORTS_WRITE 1 \
  CONFIG.SEG001_SECURE_READ 0 \
  CONFIG.SEG001_SECURE_WRITE 0 \
  CONFIG.MSC000_ROUTE 0b1 \
] [get_bd_cells s03_mmu]
create_bd_cell -type ip -vlnv xilinx.com:ip:sc_transaction_regulator:1.0 s03_transaction_regulator
set_property -dict [list \
  CONFIG.READ_WRITE_MODE WRITE_ONLY \
  CONFIG.IS_CASCADED 0 \
  CONFIG.MEP_IDENTIFIER 3 \
  CONFIG.MEP_IDENTIFIER_WIDTH 2 \
  CONFIG.ADDR_WIDTH 32 \
  CONFIG.S_ID_WIDTH 0 \
  CONFIG.WDATA_WIDTH 32 \
  CONFIG.RDATA_WIDTH 32 \
  CONFIG.SEP_ROUTE_WIDTH 1 \
  CONFIG.SUPPORTS_READ_DEADLOCK 0 \
  CONFIG.SUPPORTS_WRITE_DEADLOCK 1 \
] [get_bd_cells s03_transaction_regulator]
create_bd_cell -type ip -vlnv xilinx.com:ip:sc_si_converter:1.0 s03_si_converter
set_property -dict [list \
  CONFIG.READ_WRITE_MODE WRITE_ONLY \
  CONFIG.LIMIT_READ_LENGTH 0 \
  CONFIG.LIMIT_WRITE_LENGTH 0 \
  CONFIG.IS_CASCADED 0 \
  CONFIG.NUM_READ_THREADS 1 \
  CONFIG.NUM_WRITE_THREADS 1 \
  CONFIG.MEP_IDENTIFIER_WIDTH 2 \
  CONFIG.SUPPORTS_NARROW 0 \
  CONFIG.HAS_BURST 0 \
  CONFIG.NUM_SEG 2 \
  CONFIG.ADDR_WIDTH 32 \
  CONFIG.ID_WIDTH 2 \
  CONFIG.RDATA_WIDTH 32 \
  CONFIG.WDATA_WIDTH 32 \
  CONFIG.NUM_MSC 1 \
  CONFIG.S_RUSER_BITS_PER_BYTE 0 \
  CONFIG.S_WUSER_BITS_PER_BYTE 0 \
  CONFIG.MAX_RUSER_BITS_PER_BYTE 0 \
  CONFIG.MAX_WUSER_BITS_PER_BYTE 0 \
  CONFIG.SEP000_RDATA_WIDTH 64 \
  CONFIG.SEP000_WDATA_WIDTH 64 \
  CONFIG.SEP000_PROTOCOL AXI3 \
  CONFIG.SEP001_RDATA_WIDTH 64 \
  CONFIG.SEP001_WDATA_WIDTH 64 \
  CONFIG.SEP001_PROTOCOL AXI3 \
  CONFIG.MSC000_RDATA_WIDTH 64 \
  CONFIG.MSC000_WDATA_WIDTH 64 \
] [get_bd_cells s03_si_converter]

# ---- hierarchy /s03_nodes ----
current_bd_instance /s03_nodes
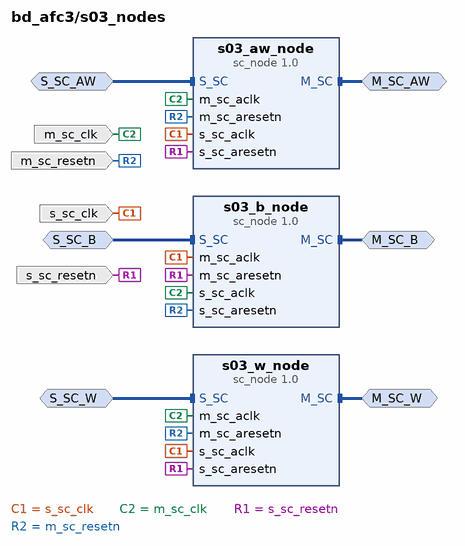
[diagram p10: block diagram inside /s03_nodes]
create_bd_intf_pin -mode Master -vlnv xilinx.com:interface:sc_rtl:1.0 M_SC_AW
create_bd_intf_pin -mode Slave -vlnv xilinx.com:interface:sc_rtl:1.0 S_SC_AW
create_bd_intf_pin -mode Master -vlnv xilinx.com:interface:sc_rtl:1.0 M_SC_W
create_bd_intf_pin -mode Slave -vlnv xilinx.com:interface:sc_rtl:1.0 S_SC_W
create_bd_intf_pin -mode Master -vlnv xilinx.com:interface:sc_rtl:1.0 M_SC_B
create_bd_intf_pin -mode Slave -vlnv xilinx.com:interface:sc_rtl:1.0 S_SC_B
create_bd_pin -dir I -type clk s_sc_clk
create_bd_pin -dir I -type rst s_sc_resetn
create_bd_pin -dir I -type clk m_sc_clk
create_bd_pin -dir I -type rst m_sc_resetn

create_bd_cell -type ip -vlnv xilinx.com:ip:sc_node:1.0 s03_aw_node
set_property -dict [list \
  CONFIG.NUM_SI 1 \
  CONFIG.NUM_MI 1 \
  CONFIG.CHANNEL 3 \
  CONFIG.MAX_PAYLD_BYTES 8 \
  CONFIG.SC_ROUTE_WIDTH 1 \
  CONFIG.ID_WIDTH 2 \
  CONFIG.PAYLD_WIDTH 140 \
  CONFIG.ADDR_WIDTH 32 \
  CONFIG.USER_WIDTH 0 \
  CONFIG.M_PIPELINE 0 \
  CONFIG.ACLK_RELATIONSHIP 1 \
  CONFIG.ACLKEN_CONVERSION 0 \
  CONFIG.S00_NUM_BYTES 4 \
  CONFIG.S01_NUM_BYTES 4 \
  CONFIG.S02_NUM_BYTES 4 \
  CONFIG.S03_NUM_BYTES 4 \
  CONFIG.S04_NUM_BYTES 4 \
  CONFIG.S05_NUM_BYTES 4 \
  CONFIG.S06_NUM_BYTES 4 \
  CONFIG.S07_NUM_BYTES 4 \
  CONFIG.S08_NUM_BYTES 4 \
  CONFIG.S09_NUM_BYTES 4 \
  CONFIG.S10_NUM_BYTES 4 \
  CONFIG.S11_NUM_BYTES 4 \
  CONFIG.S12_NUM_BYTES 4 \
  CONFIG.S13_NUM_BYTES 4 \
  CONFIG.S14_NUM_BYTES 4 \
  CONFIG.S15_NUM_BYTES 4 \
  CONFIG.M00_NUM_BYTES 8 \
  CONFIG.M01_NUM_BYTES 8 \
  CONFIG.M02_NUM_BYTES 8 \
  CONFIG.M03_NUM_BYTES 8 \
  CONFIG.M04_NUM_BYTES 8 \
  CONFIG.M05_NUM_BYTES 8 \
  CONFIG.M06_NUM_BYTES 8 \
  CONFIG.M07_NUM_BYTES 8 \
  CONFIG.M08_NUM_BYTES 8 \
  CONFIG.M09_NUM_BYTES 8 \
  CONFIG.M10_NUM_BYTES 8 \
  CONFIG.M11_NUM_BYTES 8 \
  CONFIG.M12_NUM_BYTES 8 \
  CONFIG.M13_NUM_BYTES 8 \
  CONFIG.M14_NUM_BYTES 8 \
  CONFIG.M15_NUM_BYTES 8 \
] [get_bd_cells s03_aw_node]
create_bd_cell -type ip -vlnv xilinx.com:ip:sc_node:1.0 s03_w_node
set_property -dict [list \
  CONFIG.NUM_SI 1 \
  CONFIG.NUM_MI 1 \
  CONFIG.CHANNEL 1 \
  CONFIG.USER_BITS_PER_BYTE 0 \
  CONFIG.MAX_PAYLD_BYTES 8 \
  CONFIG.SC_ROUTE_WIDTH 1 \
  CONFIG.ID_WIDTH 2 \
  CONFIG.PAYLD_WIDTH 88 \
  CONFIG.ADDR_WIDTH 32 \
  CONFIG.M_PIPELINE 0 \
  CONFIG.ACLK_RELATIONSHIP 1 \
  CONFIG.ACLKEN_CONVERSION 0 \
  CONFIG.S00_NUM_BYTES 4 \
  CONFIG.S01_NUM_BYTES 4 \
  CONFIG.S02_NUM_BYTES 4 \
  CONFIG.S03_NUM_BYTES 4 \
  CONFIG.S04_NUM_BYTES 4 \
  CONFIG.S05_NUM_BYTES 4 \
  CONFIG.S06_NUM_BYTES 4 \
  CONFIG.S07_NUM_BYTES 4 \
  CONFIG.S08_NUM_BYTES 4 \
  CONFIG.S09_NUM_BYTES 4 \
  CONFIG.S10_NUM_BYTES 4 \
  CONFIG.S11_NUM_BYTES 4 \
  CONFIG.S12_NUM_BYTES 4 \
  CONFIG.S13_NUM_BYTES 4 \
  CONFIG.S14_NUM_BYTES 4 \
  CONFIG.S15_NUM_BYTES 4 \
  CONFIG.M00_NUM_BYTES 8 \
  CONFIG.M01_NUM_BYTES 8 \
  CONFIG.M02_NUM_BYTES 8 \
  CONFIG.M03_NUM_BYTES 8 \
  CONFIG.M04_NUM_BYTES 8 \
  CONFIG.M05_NUM_BYTES 8 \
  CONFIG.M06_NUM_BYTES 8 \
  CONFIG.M07_NUM_BYTES 8 \
  CONFIG.M08_NUM_BYTES 8 \
  CONFIG.M09_NUM_BYTES 8 \
  CONFIG.M10_NUM_BYTES 8 \
  CONFIG.M11_NUM_BYTES 8 \
  CONFIG.M12_NUM_BYTES 8 \
  CONFIG.M13_NUM_BYTES 8 \
  CONFIG.M14_NUM_BYTES 8 \
  CONFIG.M15_NUM_BYTES 8 \
] [get_bd_cells s03_w_node]
create_bd_cell -type ip -vlnv xilinx.com:ip:sc_node:1.0 s03_b_node
set_property -dict [list \
  CONFIG.NUM_SI 1 \
  CONFIG.NUM_MI 1 \
  CONFIG.CHANNEL 4 \
  CONFIG.MAX_PAYLD_BYTES 8 \
  CONFIG.SC_ROUTE_WIDTH 4 \
  CONFIG.ID_WIDTH 2 \
  CONFIG.PAYLD_WIDTH 9 \
  CONFIG.ADDR_WIDTH 32 \
  CONFIG.USER_WIDTH 0 \
  CONFIG.M_SEND_PIPELINE 0 \
  CONFIG.S_LATENCY 1 \
  CONFIG.ACLK_RELATIONSHIP 1 \
  CONFIG.ACLKEN_CONVERSION 0 \
  CONFIG.S00_NUM_BYTES 8 \
  CONFIG.S01_NUM_BYTES 8 \
  CONFIG.S02_NUM_BYTES 8 \
  CONFIG.S03_NUM_BYTES 8 \
  CONFIG.S04_NUM_BYTES 8 \
  CONFIG.S05_NUM_BYTES 8 \
  CONFIG.S06_NUM_BYTES 8 \
  CONFIG.S07_NUM_BYTES 8 \
  CONFIG.S08_NUM_BYTES 8 \
  CONFIG.S09_NUM_BYTES 8 \
  CONFIG.S10_NUM_BYTES 8 \
  CONFIG.S11_NUM_BYTES 8 \
  CONFIG.S12_NUM_BYTES 8 \
  CONFIG.S13_NUM_BYTES 8 \
  CONFIG.S14_NUM_BYTES 8 \
  CONFIG.S15_NUM_BYTES 8 \
  CONFIG.M00_NUM_BYTES 4 \
  CONFIG.M01_NUM_BYTES 4 \
  CONFIG.M02_NUM_BYTES 4 \
  CONFIG.M03_NUM_BYTES 4 \
  CONFIG.M04_NUM_BYTES 4 \
  CONFIG.M05_NUM_BYTES 4 \
  CONFIG.M06_NUM_BYTES 4 \
  CONFIG.M07_NUM_BYTES 4 \
  CONFIG.M08_NUM_BYTES 4 \
  CONFIG.M09_NUM_BYTES 4 \
  CONFIG.M10_NUM_BYTES 4 \
  CONFIG.M11_NUM_BYTES 4 \
  CONFIG.M12_NUM_BYTES 4 \
  CONFIG.M13_NUM_BYTES 4 \
  CONFIG.M14_NUM_BYTES 4 \
  CONFIG.M15_NUM_BYTES 4 \
] [get_bd_cells s03_b_node]

# ---- hierarchy /m00_nodes ----
current_bd_instance /m00_nodes
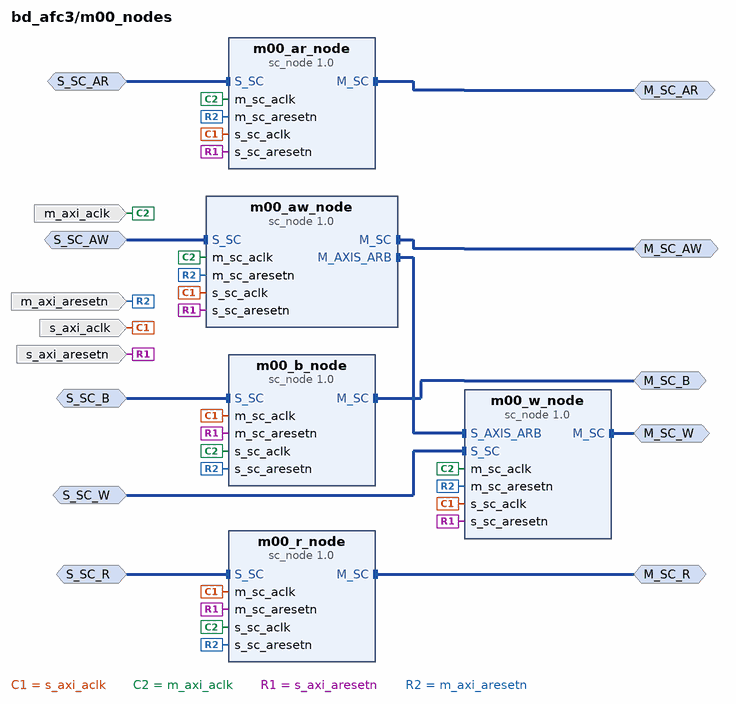
[diagram p11: block diagram inside /m00_nodes]
create_bd_intf_pin -mode Master -vlnv xilinx.com:interface:sc_rtl:1.0 M_SC_AR
create_bd_intf_pin -mode Slave -vlnv xilinx.com:interface:sc_rtl:1.0 S_SC_AR
create_bd_intf_pin -mode Master -vlnv xilinx.com:interface:sc_rtl:1.0 M_SC_R
create_bd_intf_pin -mode Slave -vlnv xilinx.com:interface:sc_rtl:1.0 S_SC_R
create_bd_intf_pin -mode Master -vlnv xilinx.com:interface:sc_rtl:1.0 M_SC_AW
create_bd_intf_pin -mode Slave -vlnv xilinx.com:interface:sc_rtl:1.0 S_SC_AW
create_bd_intf_pin -mode Master -vlnv xilinx.com:interface:sc_rtl:1.0 M_SC_W
create_bd_intf_pin -mode Slave -vlnv xilinx.com:interface:sc_rtl:1.0 S_SC_W
create_bd_intf_pin -mode Master -vlnv xilinx.com:interface:sc_rtl:1.0 M_SC_B
create_bd_intf_pin -mode Slave -vlnv xilinx.com:interface:sc_rtl:1.0 S_SC_B
create_bd_pin -dir I -type clk s_axi_aclk
create_bd_pin -dir I -type rst s_axi_aresetn
create_bd_pin -dir I -type clk m_axi_aclk
create_bd_pin -dir I -type rst m_axi_aresetn

create_bd_cell -type ip -vlnv xilinx.com:ip:sc_node:1.0 m00_ar_node
set_property -dict [list \
  CONFIG.NUM_SI 4 \
  CONFIG.NUM_MI 1 \
  CONFIG.CHANNEL 2 \
  CONFIG.MAX_PAYLD_BYTES 8 \
  CONFIG.SC_ROUTE_WIDTH 1 \
  CONFIG.ID_WIDTH 2 \
  CONFIG.PAYLD_WIDTH 140 \
  CONFIG.ADDR_WIDTH 32 \
  CONFIG.USER_WIDTH 0 \
  CONFIG.M_SEND_PIPELINE 0 \
  CONFIG.S_LATENCY 1 \
  CONFIG.ACLK_RELATIONSHIP 1 \
  CONFIG.S00_NUM_BYTES 8 \
  CONFIG.S01_NUM_BYTES 8 \
  CONFIG.S02_NUM_BYTES 8 \
  CONFIG.S03_NUM_BYTES 8 \
  CONFIG.S04_NUM_BYTES 8 \
  CONFIG.S05_NUM_BYTES 8 \
  CONFIG.S06_NUM_BYTES 8 \
  CONFIG.S07_NUM_BYTES 8 \
  CONFIG.S08_NUM_BYTES 8 \
  CONFIG.S09_NUM_BYTES 8 \
  CONFIG.S10_NUM_BYTES 8 \
  CONFIG.S11_NUM_BYTES 8 \
  CONFIG.S12_NUM_BYTES 8 \
  CONFIG.S13_NUM_BYTES 8 \
  CONFIG.S14_NUM_BYTES 8 \
  CONFIG.S15_NUM_BYTES 8 \
  CONFIG.M00_NUM_BYTES 8 \
  CONFIG.M01_NUM_BYTES 8 \
  CONFIG.M02_NUM_BYTES 8 \
  CONFIG.M03_NUM_BYTES 8 \
  CONFIG.M04_NUM_BYTES 8 \
  CONFIG.M05_NUM_BYTES 8 \
  CONFIG.M06_NUM_BYTES 8 \
  CONFIG.M07_NUM_BYTES 8 \
  CONFIG.M08_NUM_BYTES 8 \
  CONFIG.M09_NUM_BYTES 8 \
  CONFIG.M10_NUM_BYTES 8 \
  CONFIG.M11_NUM_BYTES 8 \
  CONFIG.M12_NUM_BYTES 8 \
  CONFIG.M13_NUM_BYTES 8 \
  CONFIG.M14_NUM_BYTES 8 \
  CONFIG.M15_NUM_BYTES 8 \
] [get_bd_cells m00_ar_node]
create_bd_cell -type ip -vlnv xilinx.com:ip:sc_node:1.0 m00_r_node
set_property -dict [list \
  CONFIG.NUM_SI 1 \
  CONFIG.NUM_MI 4 \
  CONFIG.CHANNEL 0 \
  CONFIG.USER_BITS_PER_BYTE 0 \
  CONFIG.MAX_PAYLD_BYTES 8 \
  CONFIG.SC_ROUTE_WIDTH 4 \
  CONFIG.ID_WIDTH 2 \
  CONFIG.PAYLD_WIDTH 87 \
  CONFIG.ADDR_WIDTH 32 \
  CONFIG.USER_WIDTH 0 \
  CONFIG.M_PIPELINE 0 \
  CONFIG.ACLK_RELATIONSHIP 1 \
  CONFIG.S00_NUM_BYTES 8 \
  CONFIG.S01_NUM_BYTES 8 \
  CONFIG.S02_NUM_BYTES 8 \
  CONFIG.S03_NUM_BYTES 8 \
  CONFIG.S04_NUM_BYTES 8 \
  CONFIG.S05_NUM_BYTES 8 \
  CONFIG.S06_NUM_BYTES 8 \
  CONFIG.S07_NUM_BYTES 8 \
  CONFIG.S08_NUM_BYTES 8 \
  CONFIG.S09_NUM_BYTES 8 \
  CONFIG.S10_NUM_BYTES 8 \
  CONFIG.S11_NUM_BYTES 8 \
  CONFIG.S12_NUM_BYTES 8 \
  CONFIG.S13_NUM_BYTES 8 \
  CONFIG.S14_NUM_BYTES 8 \
  CONFIG.S15_NUM_BYTES 8 \
  CONFIG.M00_NUM_BYTES 8 \
  CONFIG.M01_NUM_BYTES 8 \
  CONFIG.M02_NUM_BYTES 8 \
  CONFIG.M03_NUM_BYTES 8 \
  CONFIG.M04_NUM_BYTES 8 \
  CONFIG.M05_NUM_BYTES 8 \
  CONFIG.M06_NUM_BYTES 8 \
  CONFIG.M07_NUM_BYTES 8 \
  CONFIG.M08_NUM_BYTES 8 \
  CONFIG.M09_NUM_BYTES 8 \
  CONFIG.M10_NUM_BYTES 8 \
  CONFIG.M11_NUM_BYTES 8 \
  CONFIG.M12_NUM_BYTES 8 \
  CONFIG.M13_NUM_BYTES 8 \
  CONFIG.M14_NUM_BYTES 8 \
  CONFIG.M15_NUM_BYTES 8 \
] [get_bd_cells m00_r_node]
create_bd_cell -type ip -vlnv xilinx.com:ip:sc_node:1.0 m00_aw_node
set_property -dict [list \
  CONFIG.NUM_SI 4 \
  CONFIG.NUM_MI 1 \
  CONFIG.CHANNEL 3 \
  CONFIG.MAX_PAYLD_BYTES 8 \
  CONFIG.SC_ROUTE_WIDTH 1 \
  CONFIG.ID_WIDTH 2 \
  CONFIG.PAYLD_WIDTH 140 \
  CONFIG.ADDR_WIDTH 32 \
  CONFIG.USER_WIDTH 0 \
  CONFIG.M_SEND_PIPELINE 0 \
  CONFIG.S_LATENCY 1 \
  CONFIG.ACLK_RELATIONSHIP 1 \
  CONFIG.S00_NUM_BYTES 8 \
  CONFIG.S01_NUM_BYTES 8 \
  CONFIG.S02_NUM_BYTES 8 \
  CONFIG.S03_NUM_BYTES 8 \
  CONFIG.S04_NUM_BYTES 8 \
  CONFIG.S05_NUM_BYTES 8 \
  CONFIG.S06_NUM_BYTES 8 \
  CONFIG.S07_NUM_BYTES 8 \
  CONFIG.S08_NUM_BYTES 8 \
  CONFIG.S09_NUM_BYTES 8 \
  CONFIG.S10_NUM_BYTES 8 \
  CONFIG.S11_NUM_BYTES 8 \
  CONFIG.S12_NUM_BYTES 8 \
  CONFIG.S13_NUM_BYTES 8 \
  CONFIG.S14_NUM_BYTES 8 \
  CONFIG.S15_NUM_BYTES 8 \
  CONFIG.M00_NUM_BYTES 8 \
  CONFIG.M01_NUM_BYTES 8 \
  CONFIG.M02_NUM_BYTES 8 \
  CONFIG.M03_NUM_BYTES 8 \
  CONFIG.M04_NUM_BYTES 8 \
  CONFIG.M05_NUM_BYTES 8 \
  CONFIG.M06_NUM_BYTES 8 \
  CONFIG.M07_NUM_BYTES 8 \
  CONFIG.M08_NUM_BYTES 8 \
  CONFIG.M09_NUM_BYTES 8 \
  CONFIG.M10_NUM_BYTES 8 \
  CONFIG.M11_NUM_BYTES 8 \
  CONFIG.M12_NUM_BYTES 8 \
  CONFIG.M13_NUM_BYTES 8 \
  CONFIG.M14_NUM_BYTES 8 \
  CONFIG.M15_NUM_BYTES 8 \
] [get_bd_cells m00_aw_node]
create_bd_cell -type ip -vlnv xilinx.com:ip:sc_node:1.0 m00_w_node
set_property -dict [list \
  CONFIG.NUM_SI 4 \
  CONFIG.NUM_MI 1 \
  CONFIG.CHANNEL 1 \
  CONFIG.USER_BITS_PER_BYTE 0 \
  CONFIG.MAX_PAYLD_BYTES 8 \
  CONFIG.SC_ROUTE_WIDTH 1 \
  CONFIG.ID_WIDTH 2 \
  CONFIG.PAYLD_WIDTH 88 \
  CONFIG.ADDR_WIDTH 32 \
  CONFIG.USER_WIDTH 0 \
  CONFIG.M_SEND_PIPELINE 0 \
  CONFIG.S_LATENCY 1 \
  CONFIG.ACLK_RELATIONSHIP 1 \
  CONFIG.S00_NUM_BYTES 8 \
  CONFIG.S01_NUM_BYTES 8 \
  CONFIG.S02_NUM_BYTES 8 \
  CONFIG.S03_NUM_BYTES 8 \
  CONFIG.S04_NUM_BYTES 8 \
  CONFIG.S05_NUM_BYTES 8 \
  CONFIG.S06_NUM_BYTES 8 \
  CONFIG.S07_NUM_BYTES 8 \
  CONFIG.S08_NUM_BYTES 8 \
  CONFIG.S09_NUM_BYTES 8 \
  CONFIG.S10_NUM_BYTES 8 \
  CONFIG.S11_NUM_BYTES 8 \
  CONFIG.S12_NUM_BYTES 8 \
  CONFIG.S13_NUM_BYTES 8 \
  CONFIG.S14_NUM_BYTES 8 \
  CONFIG.S15_NUM_BYTES 8 \
  CONFIG.M00_NUM_BYTES 8 \
  CONFIG.M01_NUM_BYTES 8 \
  CONFIG.M02_NUM_BYTES 8 \
  CONFIG.M03_NUM_BYTES 8 \
  CONFIG.M04_NUM_BYTES 8 \
  CONFIG.M05_NUM_BYTES 8 \
  CONFIG.M06_NUM_BYTES 8 \
  CONFIG.M07_NUM_BYTES 8 \
  CONFIG.M08_NUM_BYTES 8 \
  CONFIG.M09_NUM_BYTES 8 \
  CONFIG.M10_NUM_BYTES 8 \
  CONFIG.M11_NUM_BYTES 8 \
  CONFIG.M12_NUM_BYTES 8 \
  CONFIG.M13_NUM_BYTES 8 \
  CONFIG.M14_NUM_BYTES 8 \
  CONFIG.M15_NUM_BYTES 8 \
] [get_bd_cells m00_w_node]
create_bd_cell -type ip -vlnv xilinx.com:ip:sc_node:1.0 m00_b_node
set_property -dict [list \
  CONFIG.NUM_SI 1 \
  CONFIG.NUM_MI 4 \
  CONFIG.CHANNEL 4 \
  CONFIG.MAX_PAYLD_BYTES 8 \
  CONFIG.SC_ROUTE_WIDTH 4 \
  CONFIG.ID_WIDTH 2 \
  CONFIG.PAYLD_WIDTH 9 \
  CONFIG.ADDR_WIDTH 32 \
  CONFIG.USER_WIDTH 0 \
  CONFIG.M_PIPELINE 0 \
  CONFIG.ACLK_RELATIONSHIP 1 \
  CONFIG.S00_NUM_BYTES 8 \
  CONFIG.S01_NUM_BYTES 8 \
  CONFIG.S02_NUM_BYTES 8 \
  CONFIG.S03_NUM_BYTES 8 \
  CONFIG.S04_NUM_BYTES 8 \
  CONFIG.S05_NUM_BYTES 8 \
  CONFIG.S06_NUM_BYTES 8 \
  CONFIG.S07_NUM_BYTES 8 \
  CONFIG.S08_NUM_BYTES 8 \
  CONFIG.S09_NUM_BYTES 8 \
  CONFIG.S10_NUM_BYTES 8 \
  CONFIG.S11_NUM_BYTES 8 \
  CONFIG.S12_NUM_BYTES 8 \
  CONFIG.S13_NUM_BYTES 8 \
  CONFIG.S14_NUM_BYTES 8 \
  CONFIG.S15_NUM_BYTES 8 \
  CONFIG.M00_NUM_BYTES 8 \
  CONFIG.M01_NUM_BYTES 8 \
  CONFIG.M02_NUM_BYTES 8 \
  CONFIG.M03_NUM_BYTES 8 \
  CONFIG.M04_NUM_BYTES 8 \
  CONFIG.M05_NUM_BYTES 8 \
  CONFIG.M06_NUM_BYTES 8 \
  CONFIG.M07_NUM_BYTES 8 \
  CONFIG.M08_NUM_BYTES 8 \
  CONFIG.M09_NUM_BYTES 8 \
  CONFIG.M10_NUM_BYTES 8 \
  CONFIG.M11_NUM_BYTES 8 \
  CONFIG.M12_NUM_BYTES 8 \
  CONFIG.M13_NUM_BYTES 8 \
  CONFIG.M14_NUM_BYTES 8 \
  CONFIG.M15_NUM_BYTES 8 \
] [get_bd_cells m00_b_node]
